# EAGLE board 4ESC v3.1.1 (EAGLE 6.5.0), part 1 of 2
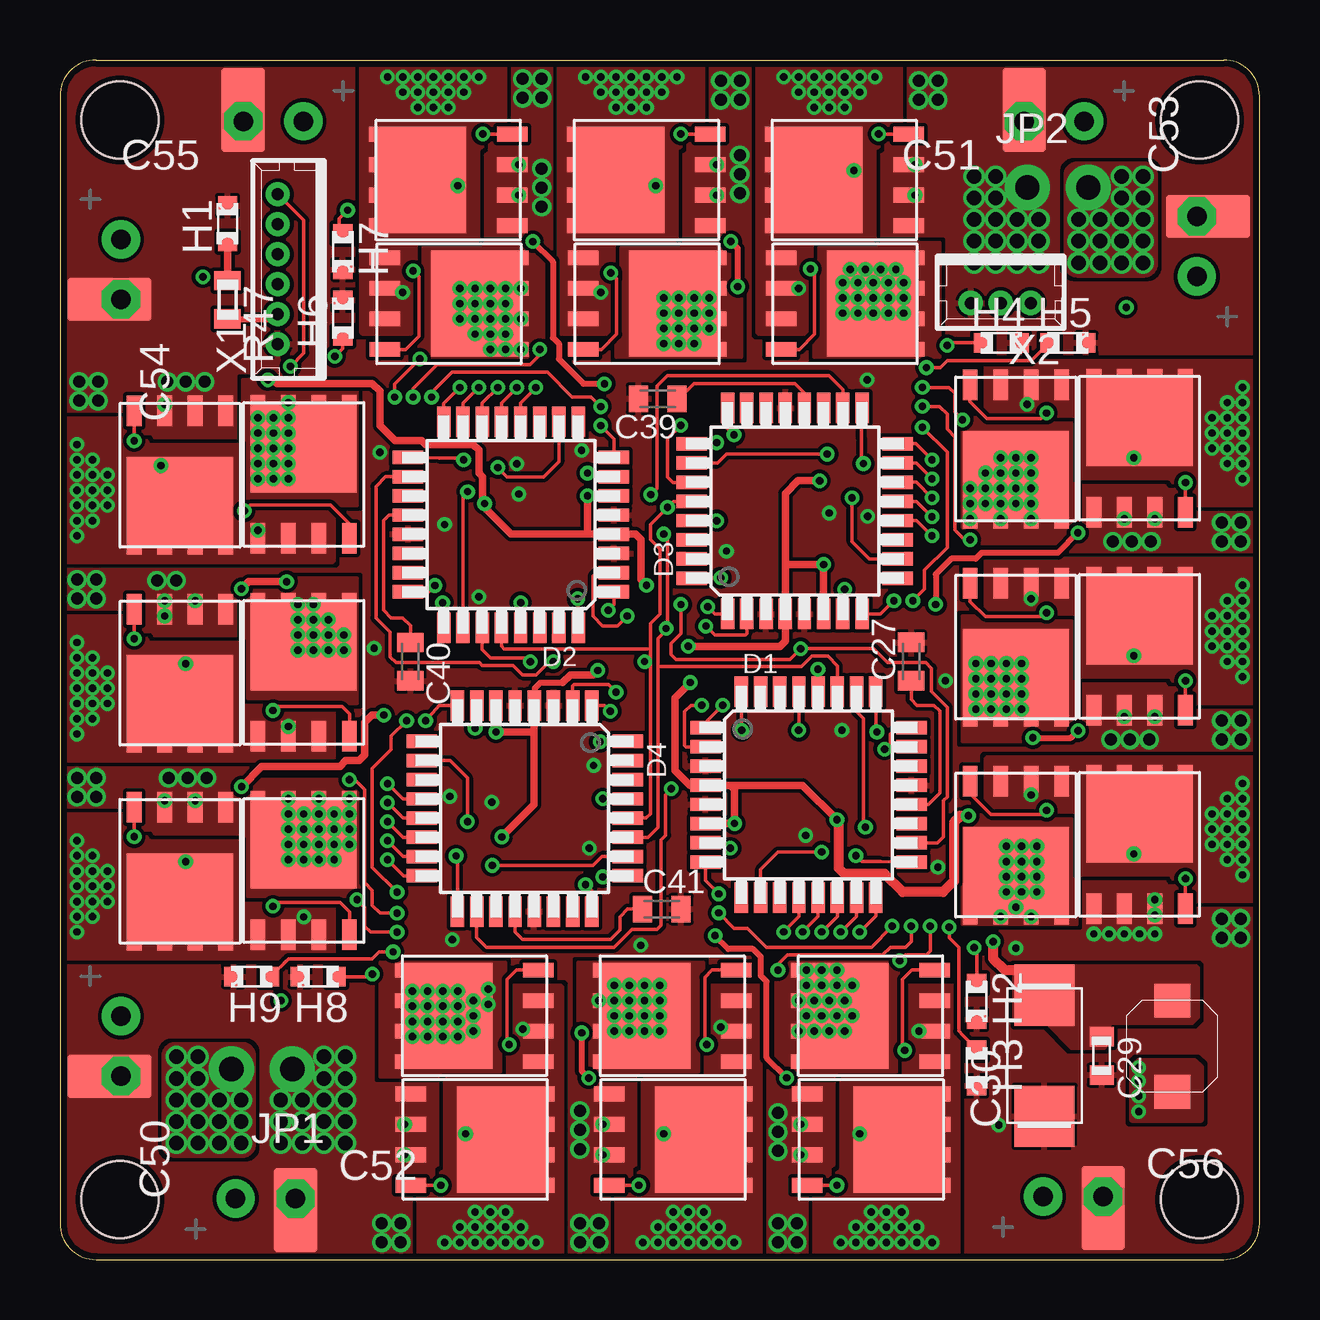
[diagram p5: board, top side]
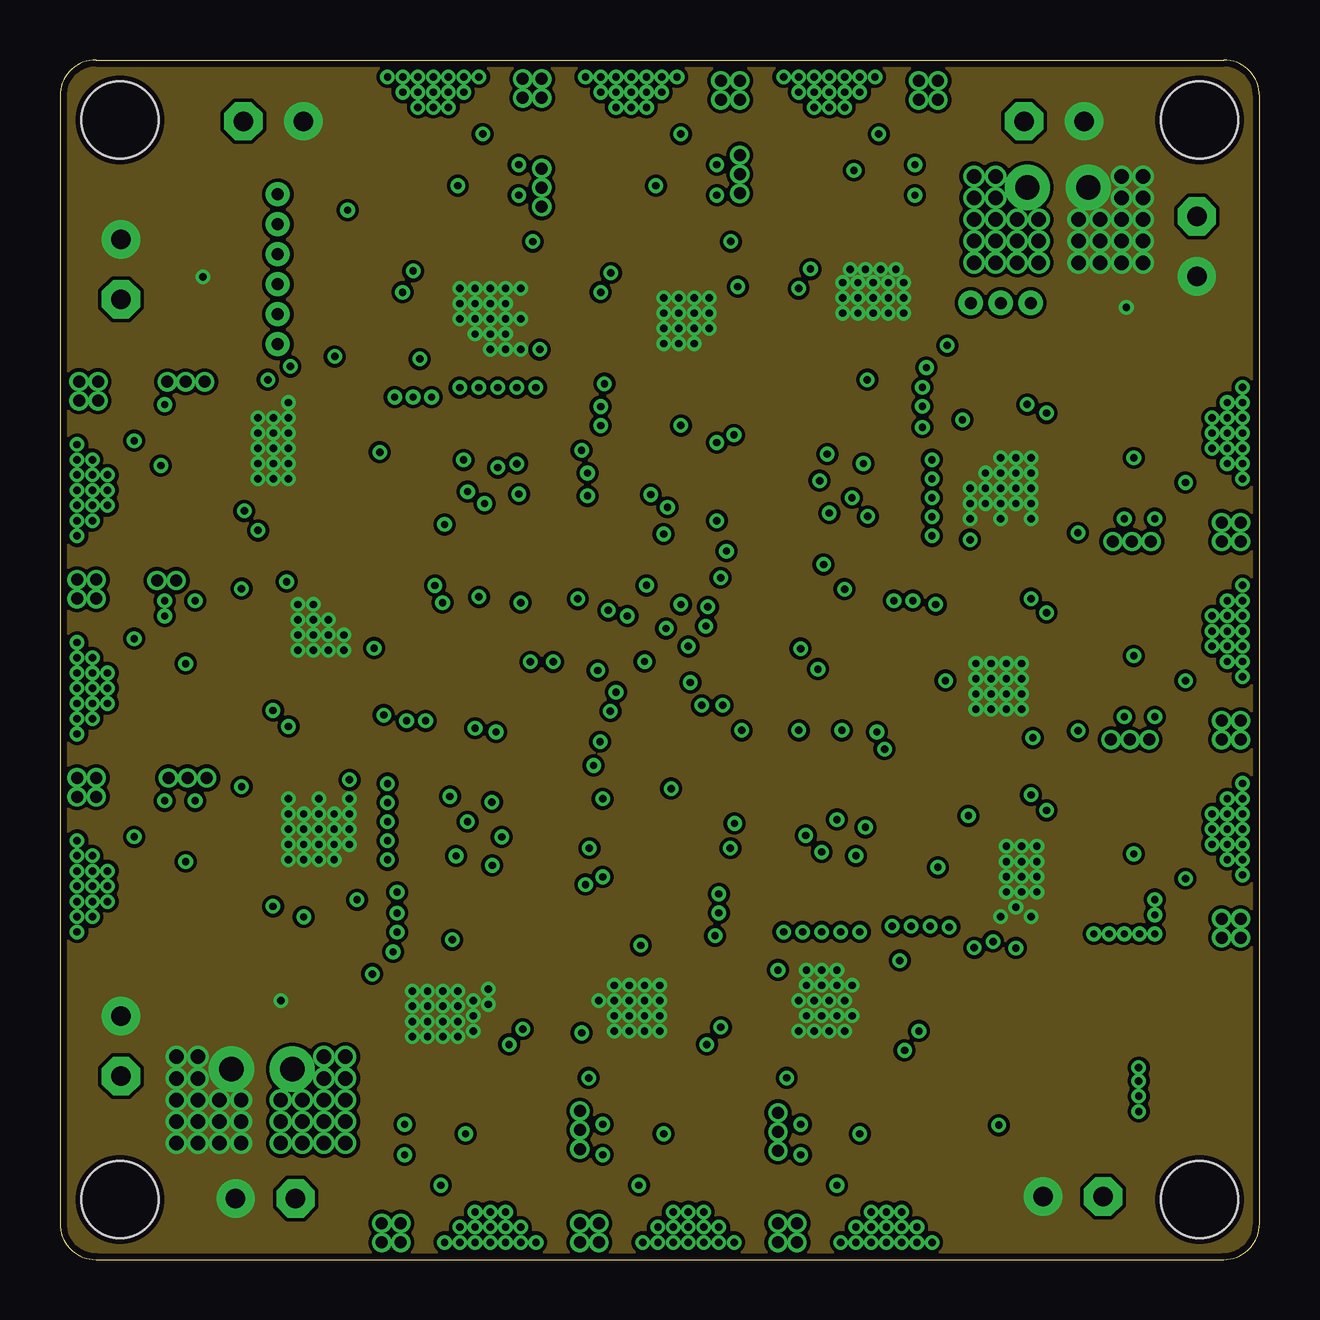
[diagram p6: board, inner layer Route2]
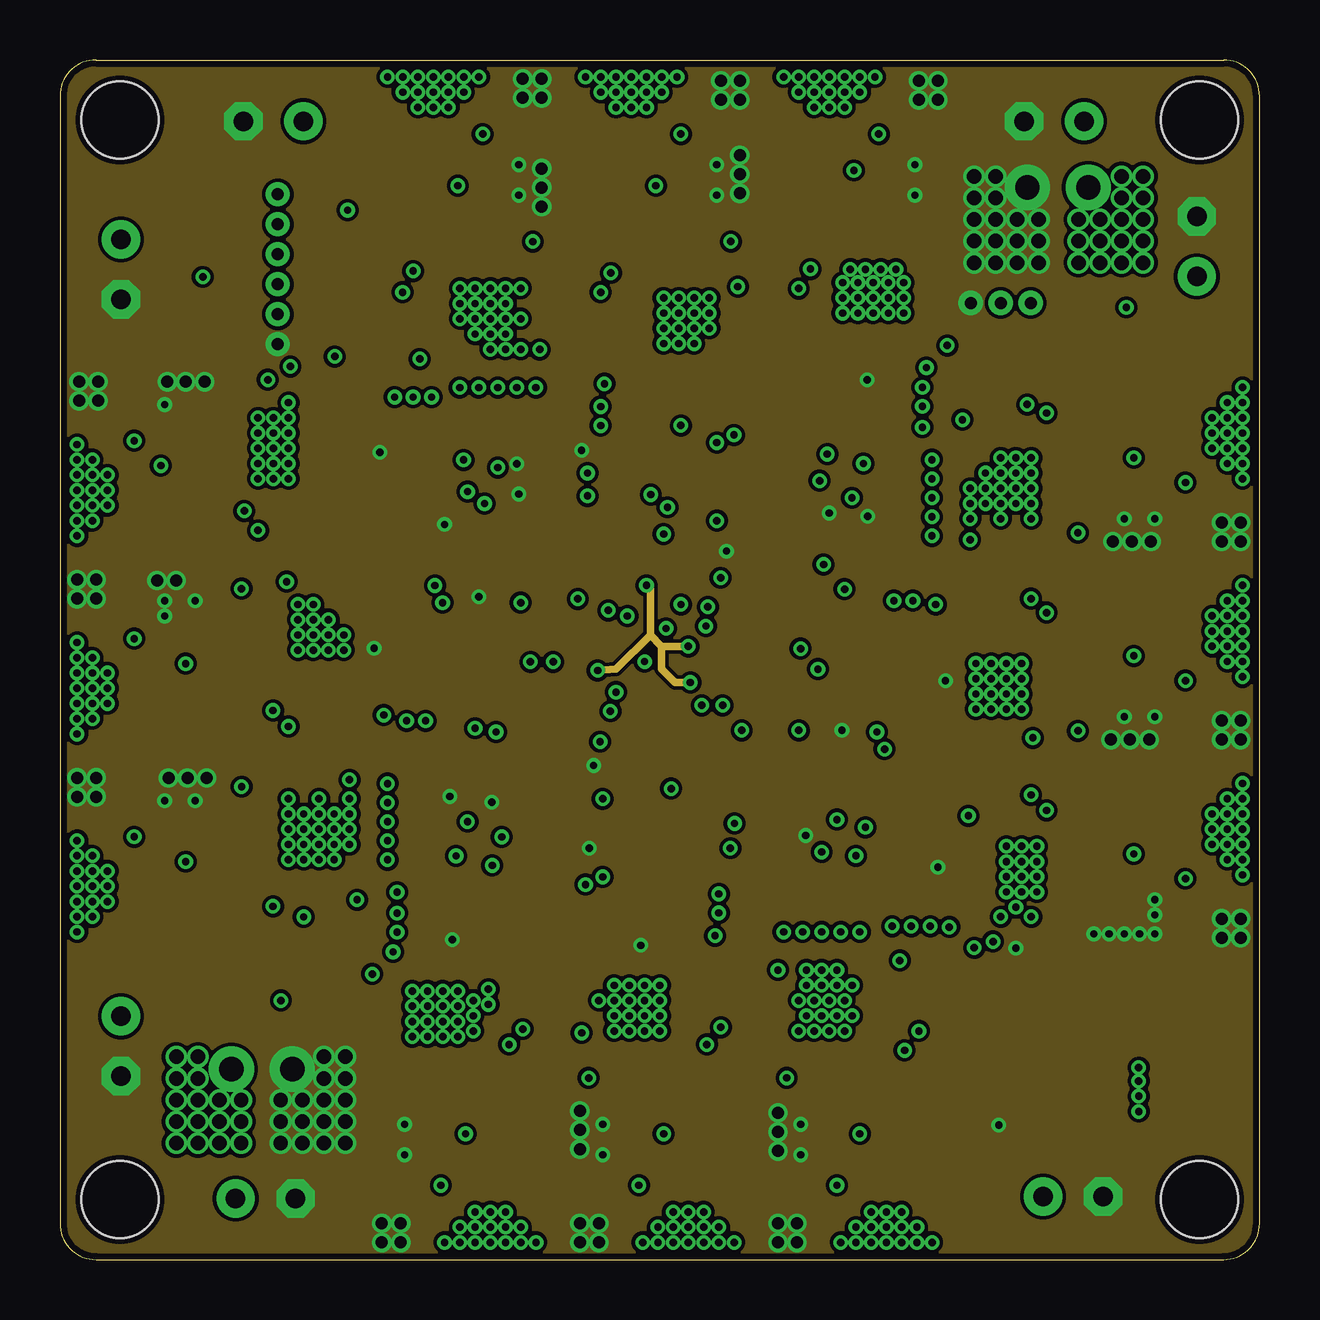
[diagram p7: board, inner layer Route15]
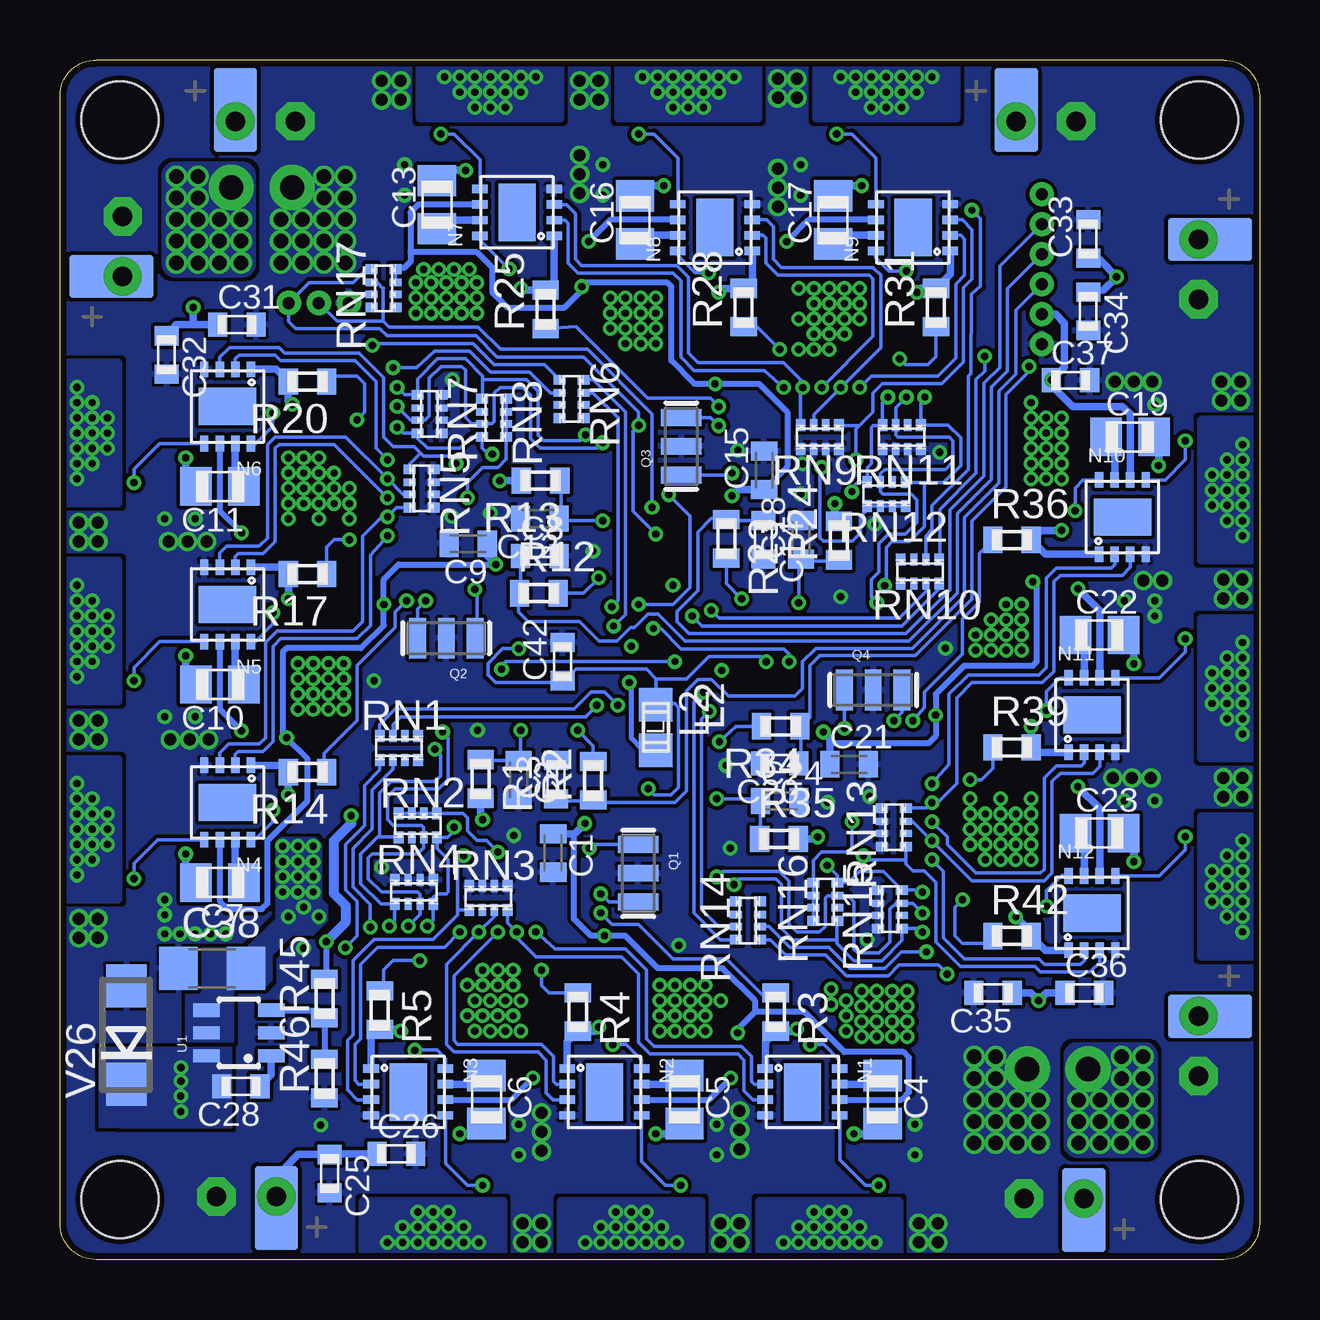
[diagram p8: board, bottom side, seen from below]

Size 50 x 50 mm. Coordinates in mm from the lower left corner, seen from the top.
Outline: 1.5,50 48.5,50 arc-90 50,48.5 50,1.5 arc-90 48.5,0 1.5,0 arc-90 0,1.5 0,48.5 arc-90 1.5,50
Copper layers (1*2*15*16): Top 0.035mm / dielectric 0.48mm / Route2 0.035mm / dielectric 0.48mm / Route15 0.035mm / dielectric 0.48mm / Bottom 0.035mm
Design rules "ITEADstudio_CAM for Eagle6_4Layer.x": minimum track width 6mil, minimum drill 12mil, track to track 6mil, track to pad 6mil, pad to pad 6mil, via to via 6mil, smd to smd 0mil, copper to edge 10mil, drill to drill 10mil, minimum pad ring 10mil, minimum via ring 6mil, stop-mask expansion 2mil, vias tented up to drill 100mil, thermal gap 0.125mm
Holes 3.2 mm at 2.5,2.5 2.5,47.5 47.5,2.5 47.5,47.5

## Footprints (pad centres in the part's own frame; a part is rotated, then mirrored left to right if it is on the bottom)
C0603K = smd 0.8 x 1.1: 1 -0.8,0; 2 0.8,0
C0603K' = smd 0.8 x 1: 1 -0.8,0; 2 0.8,0
C0805K = smd 1.3 x 1.6: 1 -1,0; 2 1,0
C/6032-28R = smd 2.55 x 2.5: + 2.525,0; - -2.525,0
C1206 = smd 1.6 x 1.8: 1 -1.4,0; 2 1.4,0
ELKO_MARTINEZ = drill 0.813 pad 1.6: + -1.25,1.27 | smd 1.8 x 3.5 bottom: +1 -1.25,0.8 | drill 0.813 pad 1.6 octagon: - 1.25,1.27 | smd 1.8 x 3.5: -1 1.25,0.8
TQFP32-08 = smd 1.27 x 0.559: 1 -4.293,2.8; 2 -4.293,2; 3 -4.293,1.2; 4 -4.293,0.4; 5 -4.293,-0.4; 6 -4.293,-1.2; 7 -4.293,-2; 8 -4.293,-2.8; 17 4.293,-2.8; 18 4.293,-2; 19 4.293,-1.2; 20 4.293,-0.4; 21 4.293,0.4; 22 4.293,1.2; 23 4.293,2; 24 4.293,2.8 | smd 0.559 x 1.27: 9 -2.8,-4.293; 10 -2,-4.293; 11 -1.2,-4.293; 12 -0.4,-4.293; 13 0.4,-4.293; 14 1.2,-4.293; 15 2,-4.293; 16 2.8,-4.293; 25 2.8,4.293; 26 2,4.293; 27 1.2,4.293; 28 0.4,4.293; 29 -0.4,4.293; 30 -1.2,4.293; 31 -2,4.293; 32 -2.8,4.293
CHIPLED_0603 = smd 0.8 x 0.8: A 0,-0.75; C 0,0.75
1X02_NO_SILK = drill 1.016 pad 1.88: 1 0,0; 2 2.54,0
CDRH4D28 = smd 1.4 x 1.5: P$1 -1.9,0; P$2 1.9,0
L0805 = smd 1.397 x 1.397: 1 -0.953,0; 2 0.953,0
DFN3X3P8 = smd 0.35 x 0.65: 1 -0.975,-1.55; 2 -0.325,-1.55; 3 0.325,-1.55; 4 0.975,-1.55; 5 0.975,1.55; 6 0.325,1.55; 7 -0.325,1.55; 8 -0.975,1.55 | smd 2.4 x 1.55: 9 0,0
RESONATOR-SMD = smd 0.7 x 1.7: 1 -1.2,0; 2 0,0; 3 1.2,0
R0603 = smd 0.8 x 1.1: 1 -0.8,0; 2 0.8,0
4X0402ARV341 = smd 0.4 x 0.5: 1 -0.8,-0.5; 4 0.8,-0.5; 5 0.8,0.5; 8 -0.8,0.5 | smd 0.3 x 0.5: 2 -0.25,-0.5; 3 0.25,-0.5; 6 0.25,0.5; 7 -0.25,0.5
SOT23-6 = smd 0.55 x 1.1: 1 -0.95,-1.35; 2 0,-1.35; 3 0.95,-1.35; 4 0.95,1.35; 5 0,1.35; 6 -0.95,1.35
POWER56 = smd 0.61 x 1.27: P$1 -1.905,-2.67; P$2 -0.635,-2.67; P$3 0.635,-2.67; P$4 1.905,-2.67; P$5 1.905,2.67; P$6 0.635,2.67; P$7 -0.635,2.67; P$8 -1.905,2.67 | smd 4.423 x 3.7: P$9 0,1.1
DO214AC = smd 1.8 x 1.7: A 2.05,0; C -2.05,0
53047-06 = drill 0.5 pad 0.698: 1 3.125,0.45; 2 1.875,0.45; 3 0.625,0.45; 4 -0.625,0.45; 5 -1.875,0.45; 6 -3.125,0.45
53047-03 = drill 0.5 pad 0.698: 1 1.25,0.45; 2 0,0.45; 3 -1.25,0.45

## Placement (x,y rotation side)
C1  100n  [C0603K]  29.45,16.94 270 bottom
C2  100n  [C0603K]  30.89,20 270 bottom
C3  470p  [C0603K']  29.33,20 90 bottom
C4  1u50V  [C0805K]  15.71,6.67 270 bottom
C5  1u50V  [C0805K]  23.97,6.67 270 bottom
C6  1u50V  [C0805K]  32.22,6.67 270 bottom
C7  1u50V  [C0805K]  43.33,15.71 180 bottom
C8  470p  [C0603K']  30,29.33 0 bottom
C9  100n  [C0603K]  32.99,29.84 180 bottom
C10  1u50V  [C0805K]  43.33,23.97 180 bottom
C11  1u50V  [C0805K]  43.33,32.22 180 bottom
C12  100n  [C0603K]  30,30.89 180 bottom
C13  1u50V  [C0805K]  34.29,43.97 90 bottom
C14  470p  [C0603K']  20.67,30 270 bottom
C15  100n  [C0603K]  20.65,32.9 90 bottom
C16  1u50V  [C0805K]  26.03,43.33 90 bottom
C17  1u50V  [C0805K]  17.78,43.33 90 bottom
C18  100n  [C0603K]  19.11,30 90 bottom
C19  1u50V  [C0805K]  5.4,34.29 0 bottom
C20  470p  [C0603K']  20,20.67 180 bottom
C21  100n  [C0603K]  17.11,20.64 0 bottom
C22  1u50V  [C0805K]  6.67,26.03 0 bottom
C23  1u50V  [C0805K]  6.67,17.78 0 bottom
C24  100n  [C0603K]  20,19.11 0 bottom
C25  100n  [C0603K']  38.76,3.58 270 bottom
C26  100n  [C0603K']  35.98,4.41 0 bottom
C27  100n  [C0603K]  35.48,24.93 90 top
C28  100n  [C0603K']  42.47,7.22 180 bottom
C29  100n  [C0603K']  43.42,8.49 270 top
C30  47u 10V  [C/6032-28R]  41.04,8.49 90 top
C31  100n  [C0603K']  42.62,38.97 0 bottom
C32  100n  [C0603K']  45.56,37.7 270 bottom
C33  100n  [C0603K']  7.14,42.55 90 bottom
C34  100n  [C0603K']  7.14,39.53 270 bottom
C35  100n  [C0603K']  11.11,11.11 180 bottom
C36  100n  [C0603K']  7.3,11.11 0 bottom
C37  100n  [C0603K']  7.88,36.65 0 bottom
C38  100n  [C1206]  43.66,12.14 0 bottom
C39  100n  [C0603K]  24.92,35.88 180 top
C40  100n  [C0603K]  14.61,24.92 270 top
C41  100n  [C0603K]  25.08,14.61 0 top
C42  100n  [C0603K']  29.05,24.92 90 bottom
C50  150µ35V1  [ELKO_MARTINEZ]  1.27,8.89 270 top
C51  150µ35V1  [ELKO_MARTINEZ]  41.43,48.72 180 top
C52  150µ35V1  [ELKO_MARTINEZ]  8.57,1.27 0 top
C53  150µ35V1  [ELKO_MARTINEZ]  48.66,42.23 90 top
C54  150µ35V1  [ELKO_MARTINEZ]  1.27,41.27 270 top
C55  150µ35V1  [ELKO_MARTINEZ]  8.89,48.72 180 top
C56  150µ35V1  [ELKO_MARTINEZ]  42.23,1.35 0 top
D1  MEGA8-AI  [TQFP32-08]  31.2,19.37 0 top
D2  MEGA8-AI  [TQFP32-08]  18.8,30.63 180 top
D3  MEGA8-AI  [TQFP32-08]  30.63,31.2 90 top
D4  MEGA8-AI  [TQFP32-08]  19.37,18.8 270 top
H1  blue  [CHIPLED_0603]  6.99,43.18 0 top
H2  GREEN  [CHIPLED_0603]  38.21,10.76 180 top
H3  RED  [CHIPLED_0603]  38.21,7.99 180 top
H4  GREEN  [CHIPLED_0603]  39.24,38.21 270 top
H5  RED  [CHIPLED_0603]  42.02,38.21 270 top
H6  GREEN  [CHIPLED_0603]  11.79,39.24 0 top
H7  RED  [CHIPLED_0603]  11.79,42.02 180 top
H8  GREEN  [CHIPLED_0603]  10.76,11.79 90 top
H9  RED  [CHIPLED_0603]  7.99,11.79 90 top
JP1  [1X02_NO_SILK]  9.68,7.94 180 top
JP2  [1X02_NO_SILK]  40.32,44.69 0 top
L1  15uH 1A  [CDRH4D28]  46.35,8.89 90 top
L2  4.7uH  [L0805]  25.16,22.18 270 bottom
N1  MCP14700  [DFN3X3P8]  19.05,6.99 270 bottom
N2  MCP14700  [DFN3X3P8]  27.3,6.99 270 bottom
N3  MCP14700  [DFN3X3P8]  35.48,6.99 270 bottom
N4  MCP14700  [DFN3X3P8]  43.02,19.05 180 bottom
N5  MCP14700  [DFN3X3P8]  43.02,27.3 180 bottom
N6  MCP14700  [DFN3X3P8]  43.02,35.56 180 bottom
N7  MCP14700  [DFN3X3P8]  30.95,43.65 90 bottom
N8  MCP14700  [DFN3X3P8]  22.7,43.02 90 bottom
N9  MCP14700  [DFN3X3P8]  14.44,43.02 90 bottom
N10  MCP14700  [DFN3X3P8]  5.71,30.95 0 bottom
N11  MCP14700  [DFN3X3P8]  6.99,22.7 0 bottom
N12  MCP14700  [DFN3X3P8]  6.99,14.44 0 bottom
Q1  16mhz  [RESONATOR-SMD]  25.9,16.1 270 bottom
Q2  16mhz  [RESONATOR-SMD]  33.9,25.9 180 bottom
Q3  16mhz  [RESONATOR-SMD]  24.1,33.9 90 bottom
Q4  16mhz  [RESONATOR-SMD]  16.1,23.74 0 bottom
R1  10k  [R0603]  32.47,20.03 270 bottom
R2  220R  [R0603]  27.78,19.96 90 bottom
R3  18k  [R0603]  20.16,10.32 270 bottom
R4  18k  [R0603]  28.42,10.32 270 bottom
R5  18k  [R0603]  36.67,10.4 270 bottom
R12  220R  [R0603]  30.04,27.78 0 bottom
R13  10k  [R0603]  29.97,32.47 180 bottom
R14  18k  [R0603]  39.68,20.32 180 bottom
R17  18k  [R0603]  39.68,28.57 180 bottom
R20  18k  [R0603]  39.68,36.59 180 bottom
R23  220R  [R0603]  22.22,30.04 270 bottom
R24  10k  [R0603]  17.53,29.97 90 bottom
R25  18k  [R0603]  29.76,39.6 90 bottom
R28  18k  [R0603]  21.5,39.68 90 bottom
R31  18k  [R0603]  13.49,39.68 90 bottom
R34  220R  [R0603]  19.96,22.22 180 bottom
R35  10k  [R0603]  20.03,17.53 0 bottom
R36  18k  [R0603]  10.32,30 0 bottom
R39  18k  [R0603]  10.32,21.35 0 bottom
R42  18k  [R0603]  10.32,13.49 0 bottom
R45  5k6  [R0603]  38.97,10.87 90 bottom
R46  1k  [R0603]  38.97,7.54 90 bottom
R47  330R  [R0603]  6.99,40.01 270 top
RN1  560R  [4X0402ARV341]  35.87,21.33 180 bottom
RN2  3k3  [4X0402ARV341]  35.08,18.1 180 bottom
RN3  10k  [4X0402ARV341]  32.15,15.08 180 bottom
RN4  3k3  [4X0402ARV341]  35.24,15.32 180 bottom
RN5  10k  [4X0402ARV341]  34.92,32.15 90 bottom
RN6  560R  [4X0402ARV341]  28.67,35.87 90 bottom
RN7  3k3  [4X0402ARV341]  34.6,35.24 90 bottom
RN8  3k3  [4X0402ARV341]  31.9,35.08 90 bottom
RN9  10k  [4X0402ARV341]  18.33,34.28 0 bottom
RN10  560R  [4X0402ARV341]  14.15,28.67 0 bottom
RN11  3k3  [4X0402ARV341]  14.92,34.28 0 bottom
RN12  3k3  [4X0402ARV341]  15.55,31.9 0 bottom
RN13  10k  [4X0402ARV341]  15.24,18.01 270 bottom
RN14  560R  [4X0402ARV341]  21.33,14.13 270 bottom
RN15  3k3  [4X0402ARV341]  15.4,14.6 270 bottom
RN16  3k3  [4X0402ARV341]  18.1,14.92 270 bottom
RN17  10k  [4X0402ARV341]  36.51,40.48 270 bottom
U1  LM2842  [SOT23-6]  42.55,9.45 90 bottom
U$1  M  [M]  24.92,26.75 0 top
U$2  M  [M]  27.78,4.13 0 bottom
U$3  4ESC_05MM  [4ESC_05MM_HOCH]  49.21,8.73 90 top
U$4  4ESC_05MM  [4ESC_05MM_HOCH]  20.32,3.49 0 bottom
V1  FDMS7660  [POWER56]  17.27,10.16 90 top
V2  FDMS7660  [POWER56]  17.3,5 270 top
V3  FDMS7660  [POWER56]  25.53,10.16 90 top
V4  FDMS7660  [POWER56]  25.56,5 270 top
V5  FDMS7660  [POWER56]  33.78,10.16 90 top
V6  FDMS7660  [POWER56]  33.81,5 270 top
V7  FDMS7660  [POWER56]  39.84,17.27 180 top
V8  FDMS7660  [POWER56]  45,17.3 0 top
V9  FDMS7660  [POWER56]  39.84,25.53 180 top
V10  FDMS7660  [POWER56]  45,25.56 0 top
V11  FDMS7660  [POWER56]  39.84,33.78 180 top
V12  FDMS7660  [POWER56]  45,33.81 0 top
V13  FDMS7660  [POWER56]  32.73,39.84 270 top
V14  FDMS7660  [POWER56]  32.7,45 90 top
V15  FDMS7660  [POWER56]  24.47,39.84 270 top
V16  FDMS7660  [POWER56]  24.44,45 90 top
V17  FDMS7660  [POWER56]  16.22,39.84 270 top
V18  FDMS7660  [POWER56]  16.19,45 90 top
V19  FDMS7660  [POWER56]  10.16,32.73 0 top
V20  FDMS7660  [POWER56]  5,32.7 180 top
V21  FDMS7660  [POWER56]  10.16,24.47 0 top
V22  FDMS7660  [POWER56]  5,24.44 180 top
V23  FDMS7660  [POWER56]  10.16,16.22 0 top
V24  FDMS7660  [POWER56]  5,16.19 180 top
V26  SS14  [DO214AC]  47.23,9.36 90 bottom
X1  53047-06  [53047-06]  9.53,41.27 90 top
X2  53047-03  [53047-03]  39.21,40.32 180 top